# EAGLE schematic sterownikRoletIR (EAGLE 6.1)
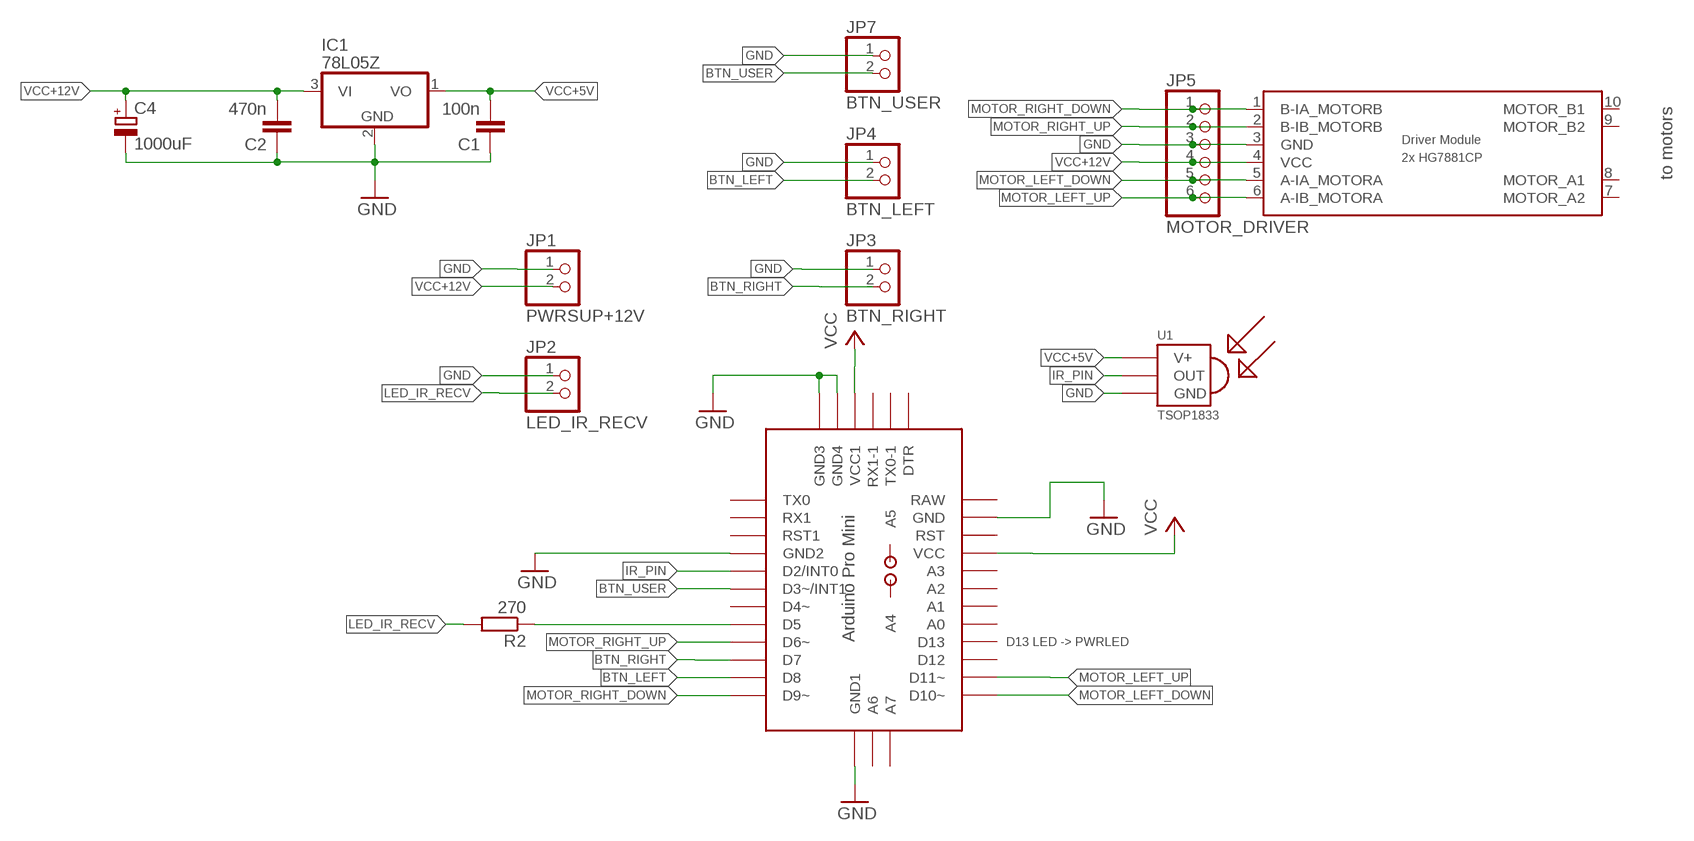
[diagram p0: schematic, sheet 1]

## Parts
C1  100n  C-EU050-024X044  [C050-024X044]
C2  470n  C-EU050-024X044  [C050-024X044]
C4  1000uF  CPOL-EUE5-10.5  [E5-10,5]
IC1  78L05Z  [TO92]
JP1  PWRSUP+12V  PINHD-1X2  [1X02]
JP2  LED_IR_RECV  PINHD-1X2  [1X02]
JP3  BTN_RIGHT  PINHD-1X2  [1X02]
JP4  BTN_LEFT  PINHD-1X2  [1X02]
JP5  MOTOR_DRIVER  PINHD-1X6  [1X06]
JP7  BTN_USER  PINHD-1X2  [1X02]
MODULE_1  MOTOR-DRIVER-MODULE-HG7881CP  [MOTOR-DRIVER-MODULE-HG7881CP]
R2  270  R-EU_0204/7  [0204/7]
U1  TSOP1833  [TSOP18XX]
U$1  ARDUINO-PRO-MINI  [ARDUINO-PRO-MINI]

## Nets
BTN_LEFT: JP4.2 U$1.D8
BTN_RIGHT: JP3.2 U$1.D7
BTN_USER: JP7.2 U$1.D3(D3~/INT1)
GND: C1.1 C2.1 C4.- IC1.2(GND) JP1.1 JP2.1 JP3.1 JP4.1 JP5.3 JP7.1 MODULE_1.3(GND) U1.GND U$1.GND U$1.GND1(GND2) U$1.GND2(GND3) U$1.GND3(GND4) U$1.GND4(GND1)
IR_PIN: U1.OUT U$1.D2(D2/INT0)
LED_IR_RECV: JP2.2 R2.2
MOTOR_LEFT_DOWN: JP5.5 MODULE_1.5(A-IA_MOTORA) U$1.D10(D10~)
MOTOR_LEFT_UP: JP5.6 MODULE_1.6(A-IB_MOTORA) U$1.D11(D11~)
MOTOR_RIGHT_DOWN: JP5.1 MODULE_1.1(B-IA_MOTORB) U$1.D9(D9~)
MOTOR_RIGHT_UP: JP5.2 MODULE_1.2(B-IB_MOTORB) U$1.D6(D6~)
N$2: R2.1 U$1.D5
VCC: U$1.VCC1
VCC+5V: C1.2 IC1.1(VO) U1.VCC(V+) U$1.VCC ; supply symbol labelled VCC
VCC+12V: C2.2 C4.+ IC1.3(VI) JP1.2 JP5.4 MODULE_1.4(VCC)
Unconnected: MODULE_1.7(MOTOR_A2) MODULE_1.8(MOTOR_A1) MODULE_1.9(MOTOR_B2) MODULE_1.10(MOTOR_B1) U$1.A0 U$1.A1 U$1.A2 U$1.A3 U$1.A4 U$1.A5 U$1.A6 U$1.A7 U$1.D4(D4~) U$1.D12 U$1.D13 U$1.DTR U$1.RAW U$1.RST U$1.RST1 U$1.RX1 U$1.RX1-1 U$1.TX0 U$1.TX0-1

## Notes on the sheet
- to motors
- D13 LED -> PWRLED

## Library data of the parts
C1 C2 = rcl:C-EU: CAPACITOR, European symbol
C4 = rcl:CPOL-EU: POLARIZED CAPACITOR, European symbol
IC1 = linear:78*: Positive VOLTAGE REGULATOR Source: http://cache.national.com/ds/LM/LM78L05.pdf http://www.fairchildsemi.com/ds/LM/LM7805.pdf
JP1-JP4 JP7 = 00 MyPinheaders:PINHD-1X2: PIN HEADER
JP5 = 00 MyPinheaders:PINHD-1X6: PIN HEADER
MODULE_1 = mymodules:MOTOR-DRIVER-MODULE-HG7881CP: MOTOR-DRIVER-MODULE-HG7881CP motor driver 1xStepper 2xDCmotors VCC=2.5-12V Imax=800mA (2A peak)
R2 = rcl:R-EU_: RESISTOR, European symbol
U1 = 00 TSOP IR Receivers:TSOP1833: IR Receiver and Demodulator
U$1 = Arduino-clone:ARDUINO-PRO-MINI: Arduino Pro-Mini Arduino Clone by KubaMiszcz 2016